# Altium schematic sheet LPDDR4 SDRAM_1.SchDoc
size 420 x 297 mm; SheetNumber: 12; SheetTotal: 26
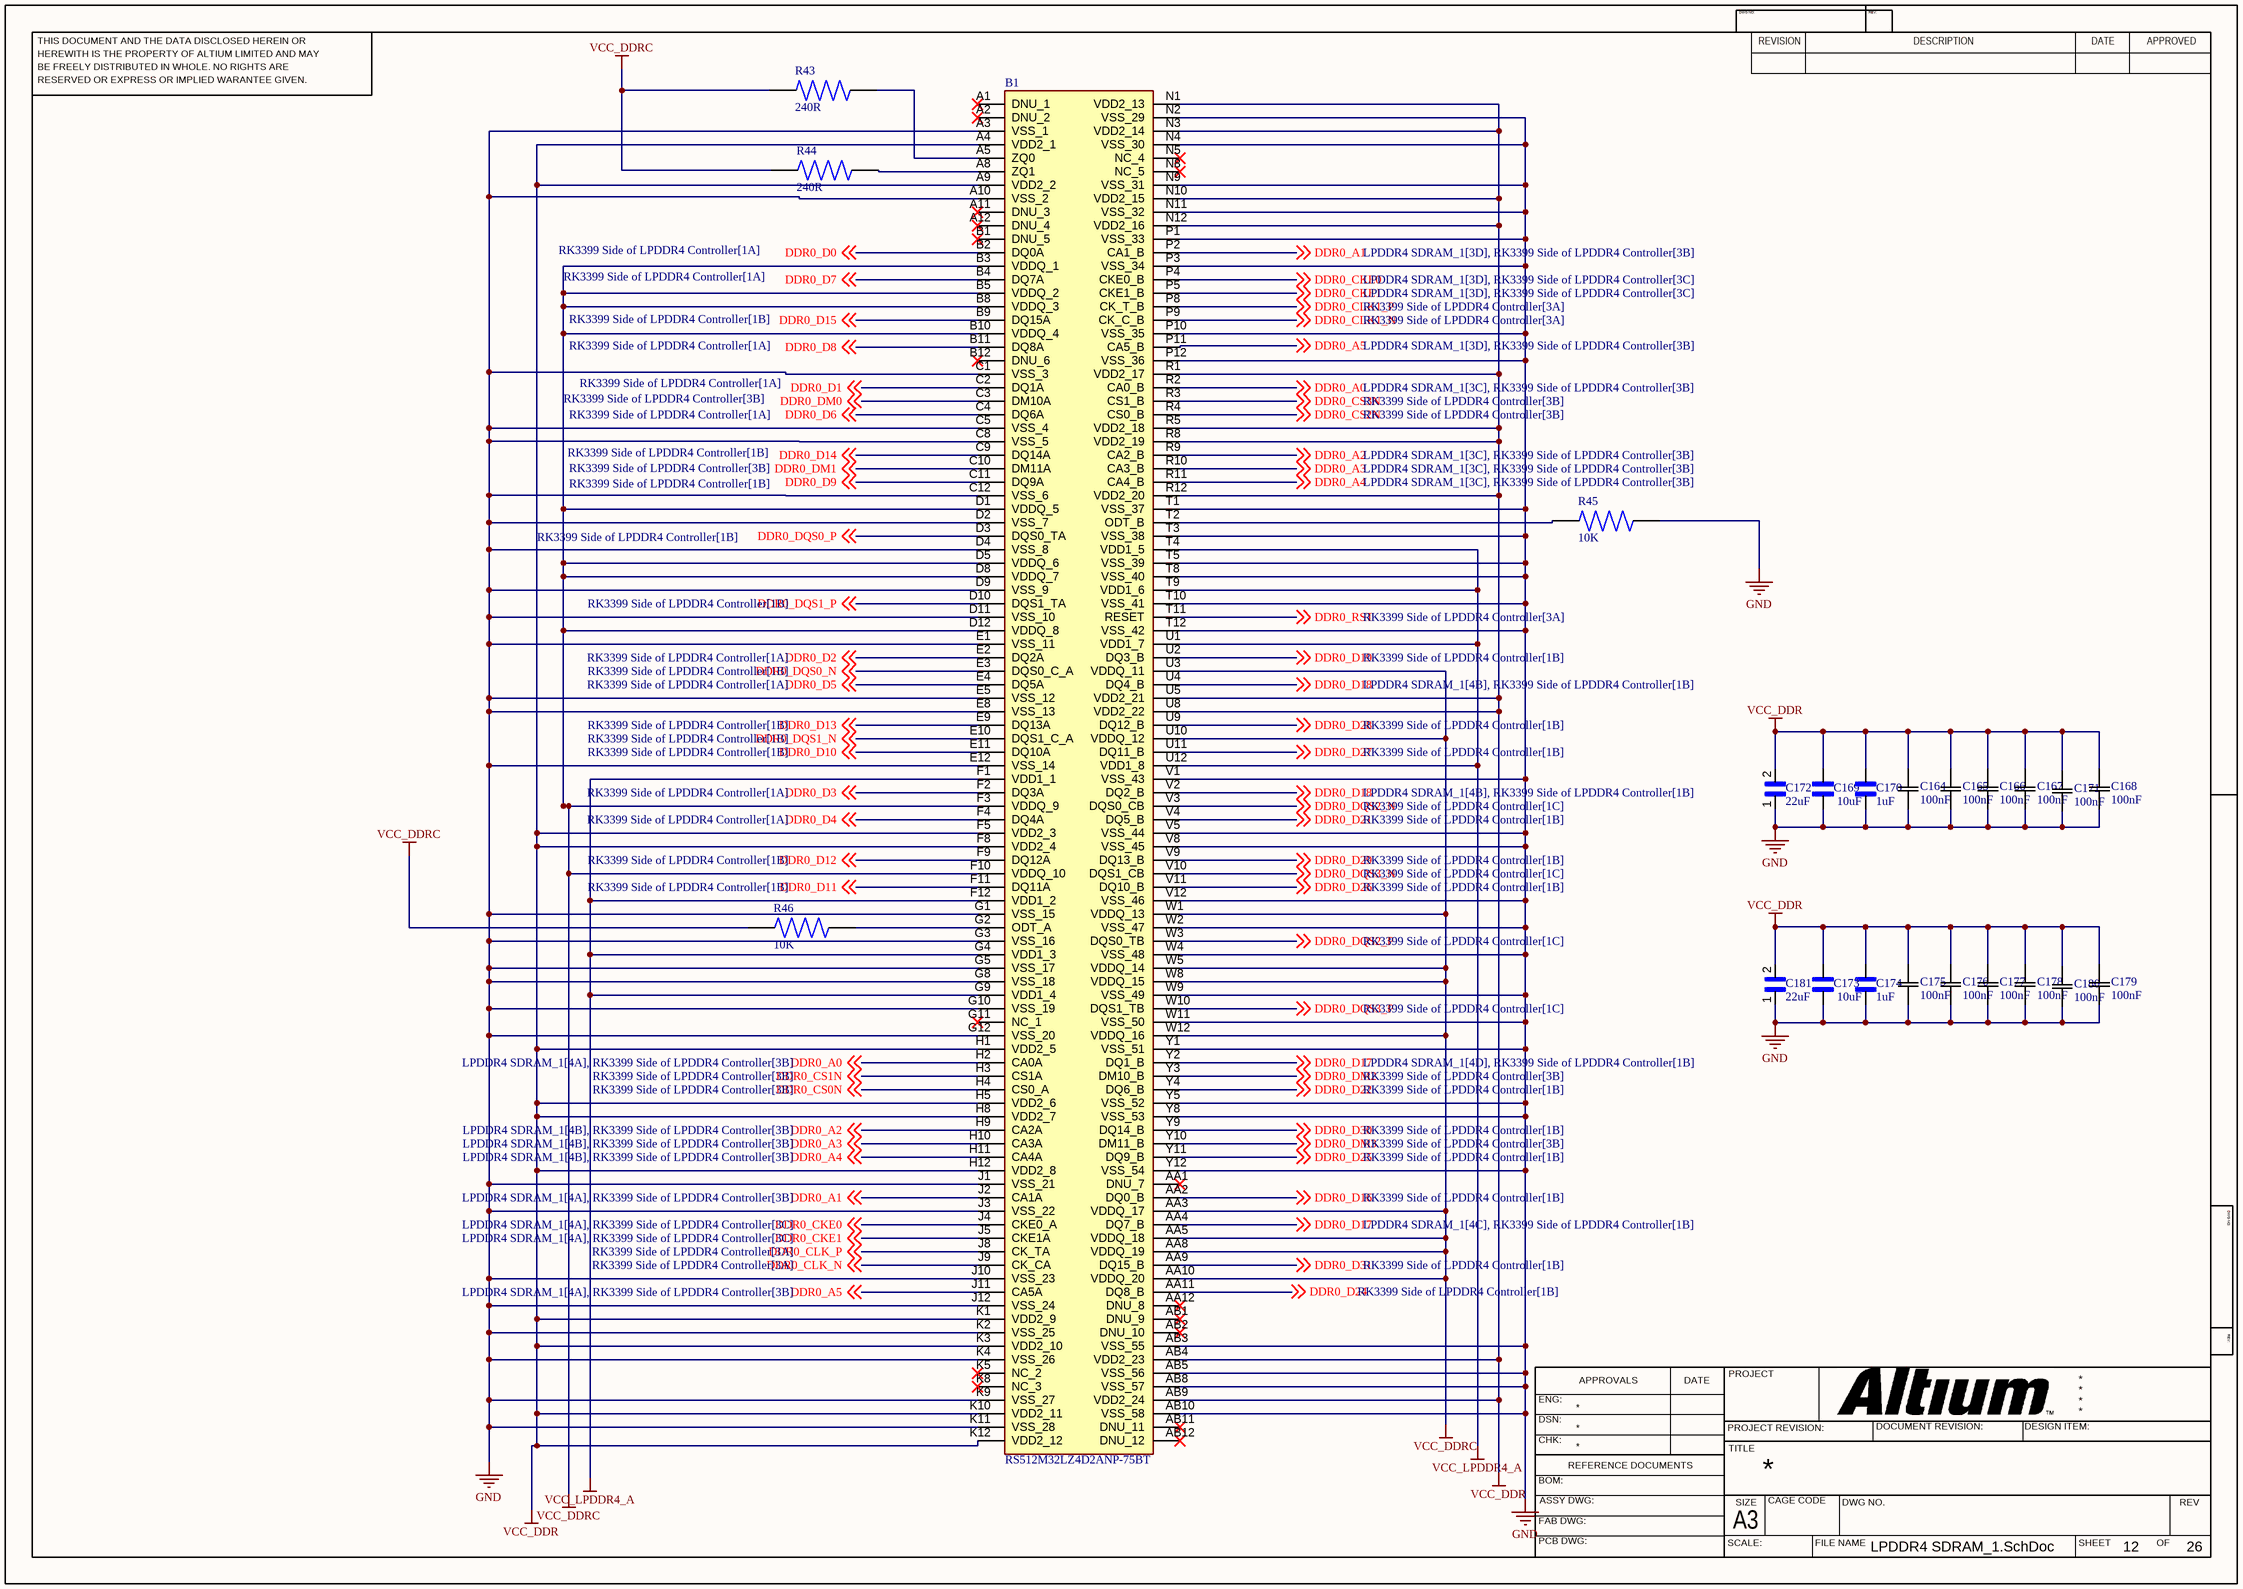
[diagram p0: LPDDR4 SDRAM_1.SchDoc]

## Parts
B1  RS512M32LZ4D2ANP-75BT  [BGA200C65P12X22_1000X1500X100]
C164  100nF  [CAP_1005_TDK]
C165  100nF  [CAP_1005_TDK]
C166  100nF  [CAP_1005_TDK]
C167  100nF  [CAP_1005_TDK]
C168  100nF  [CAP_1005_TDK]
C169  10uF  [CAPC1005X70N]
C170  1uF  [CAPC1005X56N]
C171  100nF  [CAP_1005_TDK]
C172  22uF  [CAPC6050X550N]
C173  10uF  [CAPC1005X70N]
C174  1uF  [CAPC1005X56N]
C175  100nF  [CAP_1005_TDK]
C176  100nF  [CAP_1005_TDK]
C177  100nF  [CAP_1005_TDK]
C178  100nF  [CAP_1005_TDK]
C179  100nF  [CAP_1005_TDK]
C180  100nF  [CAP_1005_TDK]
C181  22uF  [CAPC6050X550N]
R43  240R  [RESC1608X50N]
R44  240R  [RESC1608X50N]
R45  10K  [RESC1608X55N]
R46  10K  [RESC1608X55N]

## Nets
GND: B1.A3(VSS_1) B1.A10(VSS_2) B1.AB3(VSS_55) B1.AB5(VSS_56) B1.AB8(VSS_57) B1.AB10(VSS_58) B1.C1(VSS_3) B1.C5(VSS_4) B1.C8(VSS_5) B1.C12(VSS_6) B1.D2(VSS_7) B1.D4(VSS_8) B1.D9(VSS_9) B1.D11(VSS_10) B1.E1(VSS_11) B1.E5(VSS_12) B1.E8(VSS_13) B1.E12(VSS_14) B1.G1(VSS_15) B1.G3(VSS_16) B1.G5(VSS_17) B1.G8(VSS_18) B1.G10(VSS_19) B1.G12(VSS_20) B1.J1(VSS_21) B1.J3(VSS_22) B1.J10(VSS_23) B1.J12(VSS_24) B1.K2(VSS_25) B1.K4(VSS_26) B1.K9(VSS_27) B1.K11(VSS_28) B1.N2(VSS_29) B1.N4(VSS_30) B1.N9(VSS_31) B1.N11(VSS_32) B1.P1(VSS_33) B1.P3(VSS_34) B1.P10(VSS_35) B1.P12(VSS_36) B1.T1(VSS_37) B1.T3(VSS_38) B1.T5(VSS_39) B1.T8(VSS_40) B1.T10(VSS_41) B1.T12(VSS_42) B1.V1(VSS_43) B1.V5(VSS_44) B1.V8(VSS_45) B1.V12(VSS_46) B1.W2(VSS_47) B1.W4(VSS_48) B1.W9(VSS_49) B1.W11(VSS_50) B1.Y1(VSS_51) B1.Y5(VSS_52) B1.Y8(VSS_53) B1.Y12(VSS_54) C164.1 C165.1 C166.1 C167.1 C168.1 C169.1 C170.1 C171.1 C172.1 C173.1 C174.1 C175.1 C176.1 C177.1 C178.1 C179.1 C180.1 C181.1 R45.2
VCC_DDR: B1.A4(VDD2_1) B1.A9(VDD2_2) B1.AB4(VDD2_23) B1.AB9(VDD2_24) B1.F5(VDD2_3) B1.F8(VDD2_4) B1.H1(VDD2_5) B1.H5(VDD2_6) B1.H8(VDD2_7) B1.H12(VDD2_8) B1.K1(VDD2_9) B1.K3(VDD2_10) B1.K10(VDD2_11) B1.K12(VDD2_12) B1.N1(VDD2_13) B1.N3(VDD2_14) B1.N10(VDD2_15) B1.N12(VDD2_16) B1.R1(VDD2_17) B1.R5(VDD2_18) B1.R8(VDD2_19) B1.R12(VDD2_20) B1.U5(VDD2_21) B1.U8(VDD2_22) C164.2 C165.2 C166.2 C167.2 C168.2 C169.2 C170.2 C171.2 C172.2 C173.2 C174.2 C175.2 C176.2 C177.2 C178.2 C179.2 C180.2 C181.2
VCC_DDRC: B1.AA3(VDDQ_17) B1.AA5(VDDQ_18) B1.AA8(VDDQ_19) B1.AA10(VDDQ_20) B1.B3(VDDQ_1) B1.B5(VDDQ_2) B1.B8(VDDQ_3) B1.B10(VDDQ_4) B1.D1(VDDQ_5) B1.D5(VDDQ_6) B1.D8(VDDQ_7) B1.D12(VDDQ_8) B1.F3(VDDQ_9) B1.F10(VDDQ_10) B1.U3(VDDQ_11) B1.U10(VDDQ_12) B1.W1(VDDQ_13) B1.W5(VDDQ_14) B1.W8(VDDQ_15) B1.W12(VDDQ_16) R43.1 R44.1 R46.2
VCC_LPDDR4_A: B1.F1(VDD1_1) B1.F12(VDD1_2) B1.G4(VDD1_3) B1.G9(VDD1_4) B1.T4(VDD1_5) B1.T9(VDD1_6) B1.U1(VDD1_7) B1.U12(VDD1_8)
DDR0_A0: B1.H2(CA0A) B1.R2(CA0_B) ; off-sheet DDR0_A0
DDR0_A1: B1.J2(CA1A) B1.P2(CA1_B) ; off-sheet DDR0_A1
DDR0_A2: B1.H9(CA2A) B1.R9(CA2_B) ; off-sheet DDR0_A2
DDR0_A3: B1.H10(CA3A) B1.R10(CA3_B) ; off-sheet DDR0_A3
DDR0_A4: B1.H11(CA4A) B1.R11(CA4_B) ; off-sheet DDR0_A4
DDR0_A5: B1.J11(CA5A) B1.P11(CA5_B) ; off-sheet DDR0_A5
DDR0_CKE0: B1.J4(CKE0_A) B1.P4(CKE0_B) ; off-sheet DDR0_CKE0
DDR0_CKE1: B1.J5(CKE1A) B1.P5(CKE1_B) ; off-sheet DDR0_CKE1
DDR0_CLK1_N: B1.P9(CK_C_B) ; off-sheet DDR0_CLK1_N
DDR0_CLK1_P: B1.P8(CK_T_B) ; off-sheet DDR0_CLK1_P
DDR0_CLK_N: B1.J9(CK_CA) ; off-sheet DDR0_CLK_N
DDR0_CLK_P: B1.J8(CK_TA) ; off-sheet DDR0_CLK_P
DDR0_CS0N: B1.H4(CS0_A) ; off-sheet DDR0_CS0N
DDR0_CS1N: B1.H3(CS1A) ; off-sheet DDR0_CS1N
DDR0_CS2N: B1.R4(CS0_B) ; off-sheet DDR0_CS2N
DDR0_CS3N: B1.R3(CS1_B) ; off-sheet DDR0_CS3N
DDR0_D0: B1.B2(DQ0A) ; off-sheet DDR0_D0
DDR0_D1: B1.C2(DQ1A) ; off-sheet DDR0_D1
DDR0_D2: B1.E2(DQ2A) ; off-sheet DDR0_D2
DDR0_D3: B1.F2(DQ3A) ; off-sheet DDR0_D3
DDR0_D4: B1.F4(DQ4A) ; off-sheet DDR0_D4
DDR0_D5: B1.E4(DQ5A) ; off-sheet DDR0_D5
DDR0_D6: B1.C4(DQ6A) ; off-sheet DDR0_D6
DDR0_D7: B1.B4(DQ7A) ; off-sheet DDR0_D7
DDR0_D8: B1.B11(DQ8A) ; off-sheet DDR0_D8
DDR0_D9: B1.C11(DQ9A) ; off-sheet DDR0_D9
DDR0_D10: B1.E11(DQ10A) ; off-sheet DDR0_D10
DDR0_D11: B1.F11(DQ11A) ; off-sheet DDR0_D11
DDR0_D12: B1.F9(DQ12A) ; off-sheet DDR0_D12
DDR0_D13: B1.E9(DQ13A) ; off-sheet DDR0_D13
DDR0_D14: B1.C9(DQ14A) ; off-sheet DDR0_D14
DDR0_D15: B1.B9(DQ15A) ; off-sheet DDR0_D15
DDR0_D16: B1.AA2(DQ0_B) ; off-sheet DDR0_D16
DDR0_D17: B1.AA4(DQ7_B) B1.Y2(DQ1_B) ; off-sheet DDR0_D17
DDR0_D18: B1.U4(DQ4_B) B1.V2(DQ2_B) ; off-sheet DDR0_D18
DDR0_D19: B1.U2(DQ3_B) ; off-sheet DDR0_D19
DDR0_D21: B1.V4(DQ5_B) ; off-sheet DDR0_D21
DDR0_D22: B1.Y4(DQ6_B) ; off-sheet DDR0_D22
DDR0_D24: B1.AA11(DQ8_B) ; off-sheet DDR0_D24
DDR0_D25: B1.Y11(DQ9_B) ; off-sheet DDR0_D25
DDR0_D26: B1.V11(DQ10_B) ; off-sheet DDR0_D26
DDR0_D27: B1.U11(DQ11_B) ; off-sheet DDR0_D27
DDR0_D28: B1.U9(DQ12_B) ; off-sheet DDR0_D28
DDR0_D29: B1.V9(DQ13_B) ; off-sheet DDR0_D29
DDR0_D30: B1.Y9(DQ14_B) ; off-sheet DDR0_D30
DDR0_D31: B1.AA9(DQ15_B) ; off-sheet DDR0_D31
DDR0_DM0: B1.C3(DM10A) ; off-sheet DDR0_DM0
DDR0_DM1: B1.C10(DM11A) ; off-sheet DDR0_DM1
DDR0_DM2: B1.Y3(DM10_B) ; off-sheet DDR0_DM2
DDR0_DM3: B1.Y10(DM11_B) ; off-sheet DDR0_DM3
DDR0_DQS0_N: B1.E3(DQS0_C_A) ; off-sheet DDR0_DQS0_N
DDR0_DQS0_P: B1.D3(DQS0_TA) ; off-sheet DDR0_DQS0_P
DDR0_DQS1_N: B1.E10(DQS1_C_A) ; off-sheet DDR0_DQS1_N
DDR0_DQS1_P: B1.D10(DQS1_TA) ; off-sheet DDR0_DQS1_P
DDR0_DQS2_N: B1.V3(DQS0_CB) ; off-sheet DDR0_DQS2_N
DDR0_DQS2_P: B1.W3(DQS0_TB) ; off-sheet DDR0_DQS2_P
DDR0_DQS3_N: B1.V10(DQS1_CB) ; off-sheet DDR0_DQS3_N
DDR0_DQS3_P: B1.W10(DQS1_TB) ; off-sheet DDR0_DQS3_P
DDR0_RST: B1.T11(RESET) ; off-sheet DDR0_RST
NetB1_A5: B1.A5(ZQ0) R43.2
NetB1_A8: B1.A8(ZQ1) R44.2
NetB1_G2: B1.G2(ODT_A) R46.1
NetB1_T2: B1.T2(ODT_B) R45.1

Not connected (* = marked no-connect by the designer): B1 A1(DNU_1)* A2(DNU_2)* A11(DNU_3)* A12(DNU_4)* AA1(DNU_7)* AA12(DNU_8)* AB1(DNU_9)* AB2(DNU_10)* AB11(DNU_11)* AB12(DNU_12)* B1(DNU_5)* B12(DNU_6)* G11(NC_1)* K5(NC_2)* K8(NC_3)* N5(NC_4)* N8(NC_5)*

## Notes on the sheet
- THIS DOCUMENT AND THE DATA DISCLOSED HEREIN OR
- HEREWITH IS THE PROPERTY OF ALTIUM LIMITED AND MAY
- DWG NO:
- REVISION
- REV:
- DESCRIPTION
- DATE
- APPROVED
- BE FREELY DISTRIBUTED IN WHOLE. NO RIGHTS ARE
- RESERVED OR EXPRESS OR IMPLIED WARANTEE GIVEN.
- ENG:
- APPROVALS
- PROJECT
- DSN:
- CHK:
- REFERENCE DOCUMENTS
- PROJECT REVISION:
- TITLE
- DOCUMENT REVISION:
- DESIGN ITEM:
- BOM:
- FAB DWG:
- PCB DWG:
- ASSY DWG:
- SCALE:
- A3
- SIZE
- CAGE CODE
- FILE NAME
- DWG NO.
- SHEET
- OF
- REV

## Library data of the parts
B1 = RS512M32LZ4D2ANP-75BT: BGA-200 New Arrivals ROHS; Manufacturer_Name: Rayson; Geometry.Height: 1mm; Manufacturer_Part_Number: RS512M32LZ4D2ANP-75BT; Mouser Part Number: *; Mouser Price/Stock: *; Arrow Part Number: *; Arrow Price/Stock: *; Datasheet Link: https://www.szrayson.com/uploadfiles/2020/05/20200519174828010.pdf
C164-C168 C171 C175-C180 = C1005X7R1H104M050BB: Description; Manufacturer_Name: TDK; Copyright: Copyright (C) 2025 Ultra Librarian. All rights reserved.; Manufacturer_Part_Number: C1005X7R1H104M050BB
C169 C173 = CL05A106MQ5NUNC: 10 ÂµF Â±20% 6.3V Ceramic Capacitor X5R 0402 (1005 Metric); MF: Samsung; SnapEDA_Link: https://www.snapeda.com/parts/CL05A106MQ5NUNC/Samsung/view-part/?ref=snap; Package: SMD-2 Samsung; Value: *; MP: CL05A106MQ5NUNC; Check_prices: https://www.snapeda.com/parts/CL05A106MQ5NUNC/Samsung/view-part/?ref=eda
C170 C174 = 0402ZD105KAT4A: 1 ÂµF Â±10% 10V Ceramic Capacitor X5R 0402 (1005 Metric); MF: AVX; SnapEDA_Link: https://www.snapeda.com/parts/0402ZD105KAT4A/AVX/view-part/?ref=snap; Package: 1005 AVX; Value: *; MP: 0402ZD105KAT4A; Check_prices: https://www.snapeda.com/parts/0402ZD105KAT4A/AVX/view-part/?ref=eda
C172 C181 = CKG57NX7S1H226M500JJ: 22ÂµF Â±20% 50V Ceramic Capacitor X7S Stacked SMD, 2 J-Lead; MP: CKG57NX7S1H226M500JJ; Package: None; Availability: Unavailable; Price: None; Value: *
R43 R44 = ERA6AED241V: Value: *; Availability: Unavailable; Price: None; Package: None; MP: ERA6AED241V
R45 R46 = CRCW06031K00FKECC: 1 kOhms Â±1% 0.1W, 1/10W Chip Resistor 0603 (1608 Metric) - Thick Film; MF: Vishay; SnapEDA_Link: https://www.snapeda.com/parts/CRCW06031K00FKECC/Vishay/view-part/?ref=snap; Package: 0603-2 Vishay; Value: *; MP: CRCW06031K00FKECC; Check_prices: https://www.snapeda.com/parts/CRCW06031K00FKECC/Vishay/view-part/?ref=eda